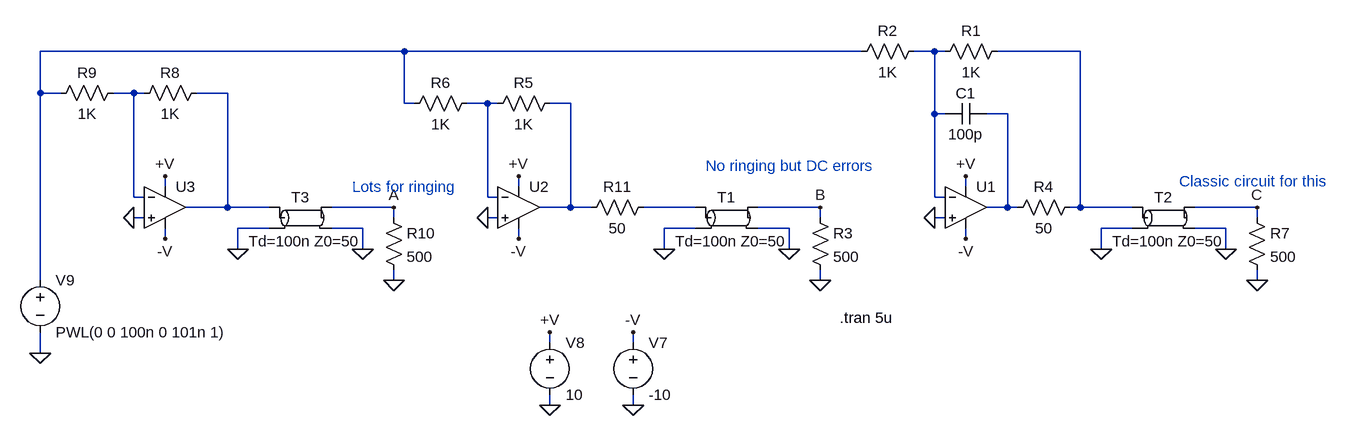
[diagram p0: schematic UOA&LinTrasm.asc]
UOA&LinTrasm.asc, the LTspice schematic file:
Version 4
SHEET 1 1588 1476
WIRE 320 736 304 736
WIRE 304 736 304 608
WIRE 304 512 320 512
WIRE 400 512 528 512
WIRE 528 512 528 752
WIRE 528 752 512 752
WIRE 304 512 272 512
WIRE 192 512 -512 512
WIRE 304 768 320 768
WIRE 432 752 416 752
WIRE 304 608 320 608
WIRE 384 608 416 608
WIRE 304 608 304 512
WIRE 416 608 416 752
WIRE 416 752 384 752
WIRE -368 736 -384 736
WIRE -384 736 -384 592
WIRE -384 592 -368 592
WIRE -288 592 -256 592
WIRE -256 592 -256 752
WIRE -384 592 -416 592
WIRE -496 592 -512 592
WIRE -384 768 -368 768
WIRE -256 752 -304 752
WIRE -768 816 -768 784
WIRE -768 784 -720 784
WIRE -624 784 -576 784
WIRE -576 784 -576 816
WIRE -528 752 -624 752
WIRE -720 752 -784 752
WIRE -288 1056 -288 1040
WIRE -880 704 -880 720
WIRE -880 784 -880 800
WIRE -160 1040 -160 1056
WIRE -912 736 -928 736
WIRE -928 736 -928 576
WIRE -960 576 -928 576
WIRE -832 576 -784 576
WIRE -784 576 -784 752
WIRE -784 752 -848 752
WIRE -1040 576 -1072 576
WIRE -1072 576 -1072 864
WIRE -928 768 -912 768
WIRE -1072 944 -1072 976
WIRE -528 752 -528 768
WIRE -528 848 -528 864
WIRE -928 576 -912 576
WIRE -224 752 -256 752
WIRE -1072 576 -1072 512
WIRE -1072 512 -512 512
WIRE -512 592 -512 512
WIRE -112 816 -112 784
WIRE -112 784 -64 784
WIRE 32 784 80 784
WIRE 80 784 80 816
WIRE 128 752 32 752
WIRE -64 752 -144 752
WIRE 128 752 128 768
WIRE 128 848 128 864
WIRE 560 816 560 784
WIRE 560 784 608 784
WIRE 704 784 752 784
WIRE 752 784 752 816
WIRE 800 752 704 752
WIRE 608 752 528 752
WIRE 800 752 800 768
WIRE 800 848 800 864
WIRE -336 704 -336 720
WIRE 352 704 352 720
WIRE -288 944 -288 960
WIRE -336 784 -336 800
WIRE 352 784 352 800
WIRE -160 960 -160 944
FLAG 304 768 0
FLAG -384 768 0
FLAG -576 816 0
FLAG -768 816 0
FLAG -160 1056 0
FLAG -288 1056 0
FLAG -1072 976 0
FLAG -928 768 0
FLAG -528 864 0
FLAG 80 816 0
FLAG -112 816 0
FLAG 128 864 0
FLAG 752 816 0
FLAG 560 816 0
FLAG 800 864 0
FLAG -528 752 A
FLAG 128 752 B
FLAG 800 752 C
FLAG -880 704 +V
FLAG -336 704 +V
FLAG 352 704 +V
FLAG -288 944 +V
FLAG -880 800 -V
FLAG -336 800 -V
FLAG 352 800 -V
FLAG -160 944 -V
SYMBOL opamps\\UniversalOpamp 352 752 R0
SYMATTR InstName U1
SYMBOL res 416 496 R90
WINDOW 0 0 56 VBottom 0
WINDOW 3 32 56 VTop 0
SYMATTR InstName R1
SYMATTR Value 1K
SYMBOL res 288 496 R90
WINDOW 0 0 56 VBottom 0
WINDOW 3 32 56 VTop 0
SYMATTR InstName R2
SYMATTR Value 1K
SYMBOL res 528 736 R90
WINDOW 0 0 56 VBottom 0
WINDOW 3 32 56 VTop 0
SYMATTR InstName R4
SYMATTR Value 50
SYMBOL cap 384 592 R90
WINDOW 0 0 32 VBottom 0
WINDOW 3 32 32 VTop 0
SYMATTR InstName C1
SYMATTR Value 100p
SYMBOL opamps\\UniversalOpamp -336 752 R0
SYMATTR InstName U2
SYMBOL res -272 576 R90
WINDOW 0 0 56 VBottom 0
WINDOW 3 32 56 VTop 0
SYMATTR InstName R5
SYMATTR Value 1K
SYMBOL res -400 576 R90
WINDOW 0 0 56 VBottom 0
WINDOW 3 32 56 VTop 0
SYMATTR InstName R6
SYMATTR Value 1K
SYMBOL tline -672 768 R0
WINDOW 3 -79 36 Left 0
SYMATTR Value Td=100n Z0=50
SYMATTR InstName T3
SYMBOL opamps\\UniversalOpamp -880 752 R0
SYMATTR InstName U3
SYMBOL voltage -160 944 R0
SYMATTR InstName V7
SYMATTR Value -10
SYMBOL voltage -288 944 R0
SYMATTR InstName V8
SYMATTR Value 10
SYMBOL res -816 560 R90
WINDOW 0 0 56 VBottom 0
WINDOW 3 32 56 VTop 0
SYMATTR InstName R8
SYMATTR Value 1K
SYMBOL res -944 560 R90
WINDOW 0 0 56 VBottom 0
WINDOW 3 32 56 VTop 0
SYMATTR InstName R9
SYMATTR Value 1K
SYMBOL voltage -1072 848 R0
SYMATTR InstName V9
SYMATTR Value PWL(0 0 100n 0 101n 1)
SYMBOL res -544 752 R0
SYMATTR InstName R10
SYMATTR Value 500
SYMBOL res -128 736 R90
WINDOW 0 0 56 VBottom 0
WINDOW 3 32 56 VTop 0
SYMATTR InstName R11
SYMATTR Value 50
SYMBOL tline -16 768 R0
WINDOW 3 -79 36 Left 0
SYMATTR Value Td=100n Z0=50
SYMATTR InstName T1
SYMBOL res 112 752 R0
SYMATTR InstName R3
SYMATTR Value 500
SYMBOL tline 656 768 R0
WINDOW 3 -79 36 Left 0
SYMATTR Value Td=100n Z0=50
SYMATTR InstName T2
SYMBOL res 784 752 R0
SYMATTR InstName R7
SYMATTR Value 500
TEXT 158 922 Left 0 !.tran 5u
TEXT -592 720 Left 0 ;Lots for ringing
TEXT -48 688 Left 0 ;No ringing but DC errors
TEXT 680 712 Left 0 ;Classic circuit for this

The netlist it stands for:
* UOA&LinTrasm.asc
XU1 0 N001 +V -V N004 level1 Avol=1Meg GBW=10Meg Vos=0 En=0 Enk=0 In=0 Ink=0 Rin=500Meg  ; pins In+ In- V+ V- OUT
R1 N002 N001 1K
R2 N001 N003 1K
R4 N002 N004 50
C1 N004 N001 100p
XU2 0 N005 +V -V N006 level1 Avol=1Meg GBW=10Meg Vos=0 En=0 Enk=0 In=0 Ink=0 Rin=500Meg  ; pins In+ In- V+ V- OUT
R5 N006 N005 1K
R6 N005 N003 1K
T3 N007 0 A 0 Td=100n Z0=50
XU3 0 N008 +V -V N007 level1 Avol=1Meg GBW=10Meg Vos=0 En=0 Enk=0 In=0 Ink=0 Rin=500Meg  ; pins In+ In- V+ V- OUT
V7 -V 0 -10
V8 +V 0 10
R8 N007 N008 1K
R9 N008 N003 1K
V9 N003 0 PWL(0 0 100n 0 101n 1)
R10 A 0 500
R11 N009 N006 50
T1 N009 0 B 0 Td=100n Z0=50
R3 B 0 500
T2 N002 0 C 0 Td=100n Z0=50
R7 C 0 500
.tran 5u
* Lots for ringing
* No ringing but DC errors
* Classic circuit for this
.lib UniversalOpAmp1.lib
.backanno
.end